# Altium schematic sheet PC3_Output.SchDoc
size 199 x 200 mm
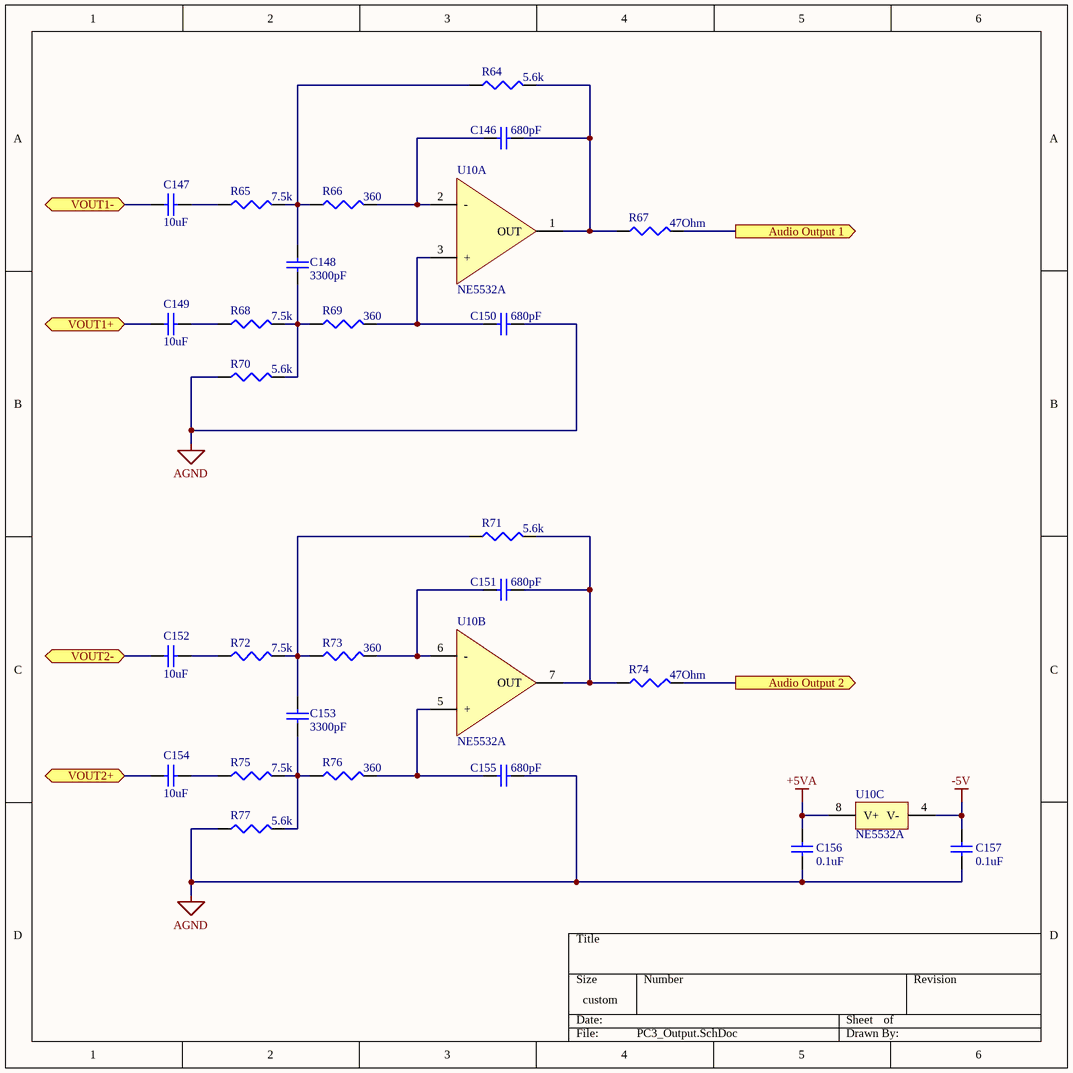
[diagram p0: PC3_Output.SchDoc]

## Parts
C146  value 680pF  [CAPC1608X08]  (hidden comment: Cap Semi)
C147  10uF  [CAPC1608X08]
C148  value 3300pF  [CAPC1608X08]  (hidden comment: Cap Semi)
C149  10uF  [CAPC1608X08]
C150  value 680pF  [CAPC1608X08]  (hidden comment: Cap Semi)
C151  value 680pF  [CAPC1608X08]  (hidden comment: Cap Semi)
C152  10uF  [CAPC1608X08]
C153  value 3300pF  [CAPC1608X08]  (hidden comment: Cap Semi)
C154  10uF  [CAPC1608X08]
C155  value 680pF  [CAPC1608X08]  (hidden comment: Cap Semi)
C156  0.1uF  [CAPC1608X08]
C157  0.1uF  [CAPC1608X08]
R64  value 5.6k  [RESC1608X05]  (hidden comment: Res3)
R65  value 7.5k  [RESC1608X05]  (hidden comment: Res3)
R66  value 360  [RESC1608X05]  (hidden comment: Res3)
R67  value 47Ohm  [RESC1608X05]  (hidden comment: Res3)
R68  value 7.5k  [RESC1608X05]  (hidden comment: Res3)
R69  value 360  [RESC1608X05]  (hidden comment: Res3)
R70  value 5.6k  [RESC1608X05]  (hidden comment: Res3)
R71  value 5.6k  [RESC1608X05]  (hidden comment: Res3)
R72  value 7.5k  [RESC1608X05]  (hidden comment: Res3)
R73  value 360  [RESC1608X05]  (hidden comment: Res3)
R74  value 47Ohm  [RESC1608X05]  (hidden comment: Res3)
R75  value 7.5k  [RESC1608X05]  (hidden comment: Res3)
R76  value 360  [RESC1608X05]  (hidden comment: Res3)
R77  value 5.6k  [RESC1608X05]  (hidden comment: Res3)
U10  NE5532A  [D8-M]  (parts A,B,C of 3)

## Ports
Audio Output 1 (out), Audio Output 2 (out), VOUT1+, VOUT1-, VOUT2+, VOUT2-

## Nets
+5VA: C156.1 U10.8(V+)
-5V: C157.1 U10.4(V-)
AGND: C150.1 C155.1 C156.2 C157.2 R70.1 R77.1
Audio Output 1: R67.2 ; port Audio Output 1
Audio Output 2: R74.2 ; port Audio Output 2
VOUT1+: C149.2 ; port VOUT1+
VOUT1-: C147.2 ; port VOUT1-
VOUT2+: C154.2 ; port VOUT2+
VOUT2-: C152.2 ; port VOUT2-
NetC146_1: C146.1 R64.2 R67.1 U10.1(OUT)
NetC146_2: C146.2 R66.2 U10.2(-)
NetC147_1: C147.1 R65.1
NetC148_1: C148.1 R64.1 R65.2 R66.1
NetC148_2: C148.2 R68.2 R69.1 R70.2
NetC149_1: C149.1 R68.1
NetC150_2: C150.2 R69.2 U10.3(+)
NetC151_1: C151.1 R71.2 R74.1 U10.7(OUT)
NetC151_2: C151.2 R73.2 U10.6(-)
NetC152_1: C152.1 R72.1
NetC153_1: C153.1 R71.1 R72.2 R73.1
NetC153_2: C153.2 R75.2 R76.1 R77.2
NetC154_1: C154.1 R75.1
NetC155_2: C155.2 R76.2 U10.5(+)

## Library data of the parts
C146 C150 C151 C155 = Cap Semi: Capacitor (Semiconductor SIM Model); Fabricant: MURATA; Fournisseur: Farnell; RefFabricant: GRT1885C1H331JA02D; RefFournisseur: 2672142; Case: 0603 [1608 Metric]; DataSheet: http://www.farnell.com/datasheets/2165943.pdf
C147 C149 C152 C154 = Cap Semi: Capacitor (Semiconductor SIM Model); Fabricant: MURATA; Fournisseur: Farnell; RefFabricant: GRM188R60J106ME47J; RefFournisseur: 2611921; Value: 10uF; Case: 0603 [1608 Metric]; DataSheet: http://www.farnell.com/datasheets/2079165.pdf
C148 C153 = Cap Semi: Capacitor (Semiconductor SIM Model); Fabricant: MURATA; Fournisseur: Farnell; RefFabricant: GRT1885C1H152JA02D; RefFournisseur: 2672137; Case: 0603 [1608 Metric]; DataSheet: http://www.farnell.com/datasheets/2165940.pdf
C156 C157 = Cap Semi: Capacitor (Semiconductor SIM Model); Fabricant: MURATA; Fournisseur: Farnell; RefFabricant: GRM188F51E104ZA01D; RefFournisseur: 2821272; Value: 0.1uF; Case: 0603 [1608 Metric]; DataSheet: http://www.farnell.com/datasheets/2048672.pdf
R64 R70 R71 R77 = Res3: Resistor; Fabricant: TE CONNECTIVITY; Fournisseur: Farnell; RefFabricant: CPF0603B11KE1; RefFournisseur: 2330892; Case: 0603 [1608 Metric]; DataSheet: http://www.farnell.com/datasheets/2104089.pdf
R65 R68 R72 R75 = Res3: Resistor; Fabricant: TE CONNECTIVITY; Fournisseur: Farnell; RefFabricant: CPF0603B15KE1; RefFournisseur: 2615493; Case: 0603 [1608 Metric]; DataSheet: http://www.farnell.com/datasheets/2170367.pdf
R66 R69 R73 R76 = Res3: Resistor; Fabricant: TE CONNECTIVITY; Fournisseur: Farnell; RefFabricant: CPF-A-0603B820RE1; RefFournisseur: 2483946; Case: 0603 [1608 Metric]; DataSheet: http://www.farnell.com/datasheets/1935020.pdf
R67 R74 = Res3: Resistor; Fabricant: TE CONNECTIVITY; Fournisseur: Farnell; RefFabricant: CPF-A-0603B47RE1; RefFournisseur: 2483931; Case: 0603 [1608 Metric]; DataSheet: http://www.farnell.com/datasheets/1935020.pdf
U10 = NE5532A: Amplificateur Opérationnel; Fabricant: TEXAS INSTRUMENTS; RefFabricant: NE5532AD; Fournisseur: Farnell; RefFournisseur: 1103060; DataSheet: http://www.ti.com/lit/ds/symlink/ne5532a.pdf